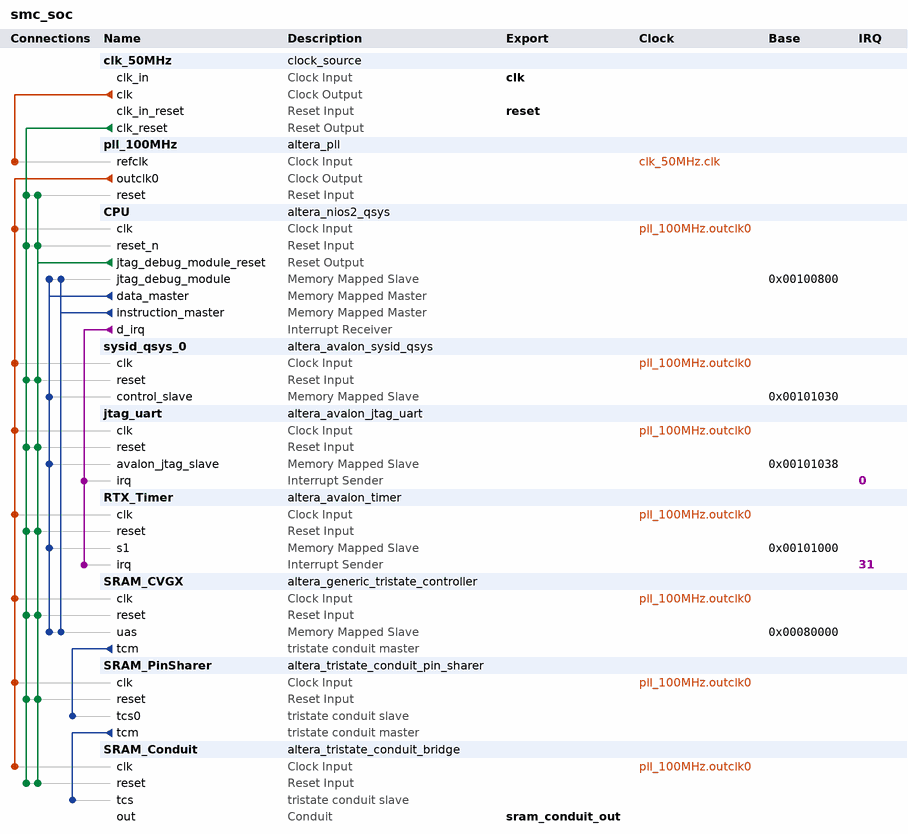
[diagram p0: system contents]
# Platform Designer (Qsys) system smc_soc, Cyclone V 5CGXFC5C6F27C7
# Parameters at their usual value, and those the tool derives, are not listed.
package require -exact qsys 14.0
create_system smc_soc
set_project_property DEVICE_FAMILY {Cyclone V}
set_project_property DEVICE 5CGXFC5C6F27C7

add_instance clk_50MHz clock_source 14.0
set_instance_parameter_value clk_50MHz clockFrequency 50000000

add_instance pll_100MHz altera_pll 14.0
set_instance_parameter_value pll_100MHz gui_device_speed_grade 1
set_instance_parameter_value pll_100MHz gui_pll_mode {Integer-N PLL}
set_instance_parameter_value pll_100MHz gui_reference_clock_frequency 50.0
set_instance_parameter_value pll_100MHz gui_operation_mode direct
set_instance_parameter_value pll_100MHz gui_use_locked false
set_instance_parameter_value pll_100MHz gui_number_of_clocks 1
set_instance_parameter_value pll_100MHz gui_output_clock_frequency0 100.0

add_instance CPU altera_nios2_qsys 14.0
set_instance_parameter_value CPU resetrequest_enabled true
set_instance_parameter_value CPU resetSlave SRAM_CVGX.uas
set_instance_parameter_value CPU mmu_TLBMissExcSlave None
set_instance_parameter_value CPU exceptionSlave SRAM_CVGX.uas
set_instance_parameter_value CPU breakSlave CPU.jtag_debug_module
set_instance_parameter_value CPU impl Tiny
set_instance_parameter_value CPU icache_size 4096

add_instance sysid_qsys_0 altera_avalon_sysid_qsys 14.0
set_instance_parameter_value sysid_qsys_0 id 67108864

add_instance jtag_uart altera_avalon_jtag_uart 14.0
set_instance_parameter_value jtag_uart simInteractiveOptions NO_INTERACTIVE_WINDOWS

add_instance RTX_Timer altera_avalon_timer 14.0
set_instance_parameter_value RTX_Timer period 10
set_instance_parameter_value RTX_Timer periodUnits MSEC

add_instance SRAM_CVGX altera_generic_tristate_controller 14.0
set_instance_parameter_value SRAM_CVGX TCM_ADDRESS_W 19
set_instance_parameter_value SRAM_CVGX TCM_DATA_W 16
set_instance_parameter_value SRAM_CVGX TCM_BYTEENABLE_W 2
set_instance_parameter_value SRAM_CVGX TCM_READ_WAIT 10
set_instance_parameter_value SRAM_CVGX TCM_WRITE_WAIT 10
set_instance_parameter_value SRAM_CVGX TCM_SETUP_WAIT 10
set_instance_parameter_value SRAM_CVGX TCM_DATA_HOLD 10
set_instance_parameter_value SRAM_CVGX TCM_MAX_PENDING_READ_TRANSACTIONS 3
set_instance_parameter_value SRAM_CVGX TCM_TURNAROUND_TIME 2
set_instance_parameter_value SRAM_CVGX TCM_TIMING_UNITS 0
set_instance_parameter_value SRAM_CVGX TCM_READLATENCY 2
set_instance_parameter_value SRAM_CVGX TCM_SYMBOLS_PER_WORD 2
set_instance_parameter_value SRAM_CVGX USE_READ 0
set_instance_parameter_value SRAM_CVGX USE_BEGINTRANSFER 0
set_instance_parameter_value SRAM_CVGX USE_BYTEENABLE 1
set_instance_parameter_value SRAM_CVGX USE_OUTPUTENABLE 1
set_instance_parameter_value SRAM_CVGX ACTIVE_LOW_READ 0
set_instance_parameter_value SRAM_CVGX ACTIVE_LOW_BYTEENABLE 1
set_instance_parameter_value SRAM_CVGX ACTIVE_LOW_OUTPUTENABLE 1
set_instance_parameter_value SRAM_CVGX ACTIVE_LOW_BEGINTRANSFER 0
set_instance_parameter_value SRAM_CVGX CHIPSELECT_THROUGH_READLATENCY 0
set_instance_parameter_value SRAM_CVGX MODULE_ASSIGNMENT_KEYS embeddedsw.configuration.hwClassnameDriverSupportList,embeddedsw.CMacro.SRAM_MEMORY_SIZE,embeddedsw.CMacro.SRAM_MEMORY_UNITS,embeddedsw.CMacro.SRAM_DATA_WIDTH,embeddedsw.memoryInfo.MEM_INIT_DATA_WIDTH,embeddedsw.memoryInfo.HAS_BYTE_LANE,embeddedsw.memoryInfo.GENERATE_DAT_SYM,embeddedsw.memoryInfo.DAT_SYM_INSTALL_DIR
set_instance_parameter_value SRAM_CVGX MODULE_ASSIGNMENT_VALUES altera_avalon_lan91c111:altera_avalon_cfi_flash,524288,1,16,16,1,1,SIM_DIR
set_instance_parameter_value SRAM_CVGX INTERFACE_ASSIGNMENT_KEYS embeddedsw.configuration.isMemoryDevice
set_instance_parameter_value SRAM_CVGX INTERFACE_ASSIGNMENT_VALUES 1

add_instance SRAM_PinSharer altera_tristate_conduit_pin_sharer 14.0
set_instance_parameter_value SRAM_PinSharer NUM_INTERFACES 1
set_instance_parameter_value SRAM_PinSharer MODULE_ORIGIN_LIST SRAM_CVGX.tcm,SRAM_CVGX.tcm,SRAM_CVGX.tcm,SRAM_CVGX.tcm,SRAM_CVGX.tcm,SRAM_CVGX.tcm
set_instance_parameter_value SRAM_PinSharer SIGNAL_ORIGIN_LIST address,outputenable_n,byteenable_n,write_n,data,chipselect_n
set_instance_parameter_value SRAM_PinSharer SHARED_SIGNAL_LIST SRAM_A,SRAM_OE_N,SRAM_BE_N,SRAM_WE_N,SRAM_D,SRAM_CE_N

add_instance SRAM_Conduit altera_tristate_conduit_bridge 14.0

# connections
add_connection clk_50MHz.clk pll_100MHz.refclk clock
add_connection pll_100MHz.outclk0 CPU.clk clock
add_connection pll_100MHz.outclk0 jtag_uart.clk clock
add_connection pll_100MHz.outclk0 RTX_Timer.clk clock
add_connection pll_100MHz.outclk0 SRAM_Conduit.clk clock
add_connection pll_100MHz.outclk0 SRAM_CVGX.clk clock
add_connection pll_100MHz.outclk0 SRAM_PinSharer.clk clock
add_connection pll_100MHz.outclk0 sysid_qsys_0.clk clock
add_connection clk_50MHz.clk_reset CPU.reset_n reset
add_connection clk_50MHz.clk_reset jtag_uart.reset reset
add_connection clk_50MHz.clk_reset pll_100MHz.reset reset
add_connection clk_50MHz.clk_reset RTX_Timer.reset reset
add_connection clk_50MHz.clk_reset SRAM_Conduit.reset reset
add_connection clk_50MHz.clk_reset SRAM_CVGX.reset reset
add_connection clk_50MHz.clk_reset SRAM_PinSharer.reset reset
add_connection clk_50MHz.clk_reset sysid_qsys_0.reset reset
add_connection CPU.jtag_debug_module_reset CPU.reset_n reset
add_connection CPU.jtag_debug_module_reset jtag_uart.reset reset
add_connection CPU.jtag_debug_module_reset pll_100MHz.reset reset
add_connection CPU.jtag_debug_module_reset RTX_Timer.reset reset
add_connection CPU.jtag_debug_module_reset SRAM_Conduit.reset reset
add_connection CPU.jtag_debug_module_reset SRAM_CVGX.reset reset
add_connection CPU.jtag_debug_module_reset SRAM_PinSharer.reset reset
add_connection CPU.jtag_debug_module_reset sysid_qsys_0.reset reset
add_connection CPU.data_master CPU.jtag_debug_module avalon
set_connection_parameter_value CPU.data_master/CPU.jtag_debug_module baseAddress 0x00100800
add_connection CPU.data_master jtag_uart.avalon_jtag_slave avalon
set_connection_parameter_value CPU.data_master/jtag_uart.avalon_jtag_slave baseAddress 0x00101038
add_connection CPU.data_master RTX_Timer.s1 avalon
set_connection_parameter_value CPU.data_master/RTX_Timer.s1 baseAddress 0x00101000
add_connection CPU.data_master SRAM_CVGX.uas avalon
set_connection_parameter_value CPU.data_master/SRAM_CVGX.uas baseAddress 0x00080000
add_connection CPU.data_master sysid_qsys_0.control_slave avalon
set_connection_parameter_value CPU.data_master/sysid_qsys_0.control_slave baseAddress 0x00101030
add_connection CPU.instruction_master CPU.jtag_debug_module avalon
set_connection_parameter_value CPU.instruction_master/CPU.jtag_debug_module baseAddress 0x00100800
add_connection CPU.instruction_master SRAM_CVGX.uas avalon
set_connection_parameter_value CPU.instruction_master/SRAM_CVGX.uas baseAddress 0x00080000
add_connection CPU.d_irq jtag_uart.irq interrupt
set_connection_parameter_value CPU.d_irq/jtag_uart.irq irqNumber 0
add_connection CPU.d_irq RTX_Timer.irq interrupt
set_connection_parameter_value CPU.d_irq/RTX_Timer.irq irqNumber 31
add_connection SRAM_CVGX.tcm SRAM_PinSharer.tcs0 tristate_conduit
add_connection SRAM_PinSharer.tcm SRAM_Conduit.tcs tristate_conduit

# exported interfaces
add_interface reset reset sink
set_interface_property reset EXPORT_OF clk_50MHz.clk_in_reset
add_interface clk clock sink
set_interface_property clk EXPORT_OF clk_50MHz.clk_in
add_interface sram_conduit_out conduit end
set_interface_property sram_conduit_out EXPORT_OF SRAM_Conduit.out

set_interconnect_requirement {$system} qsys_mm.clockCrossingAdapter HANDSHAKE
set_interconnect_requirement {$system} qsys_mm.maxAdditionalLatency 1
set_interconnect_requirement {$system} qsys_mm.insertDefaultSlave FALSE

save_system smc_soc.qsys
